# Altium project PCB_STM32F407VGT.PrjPCB
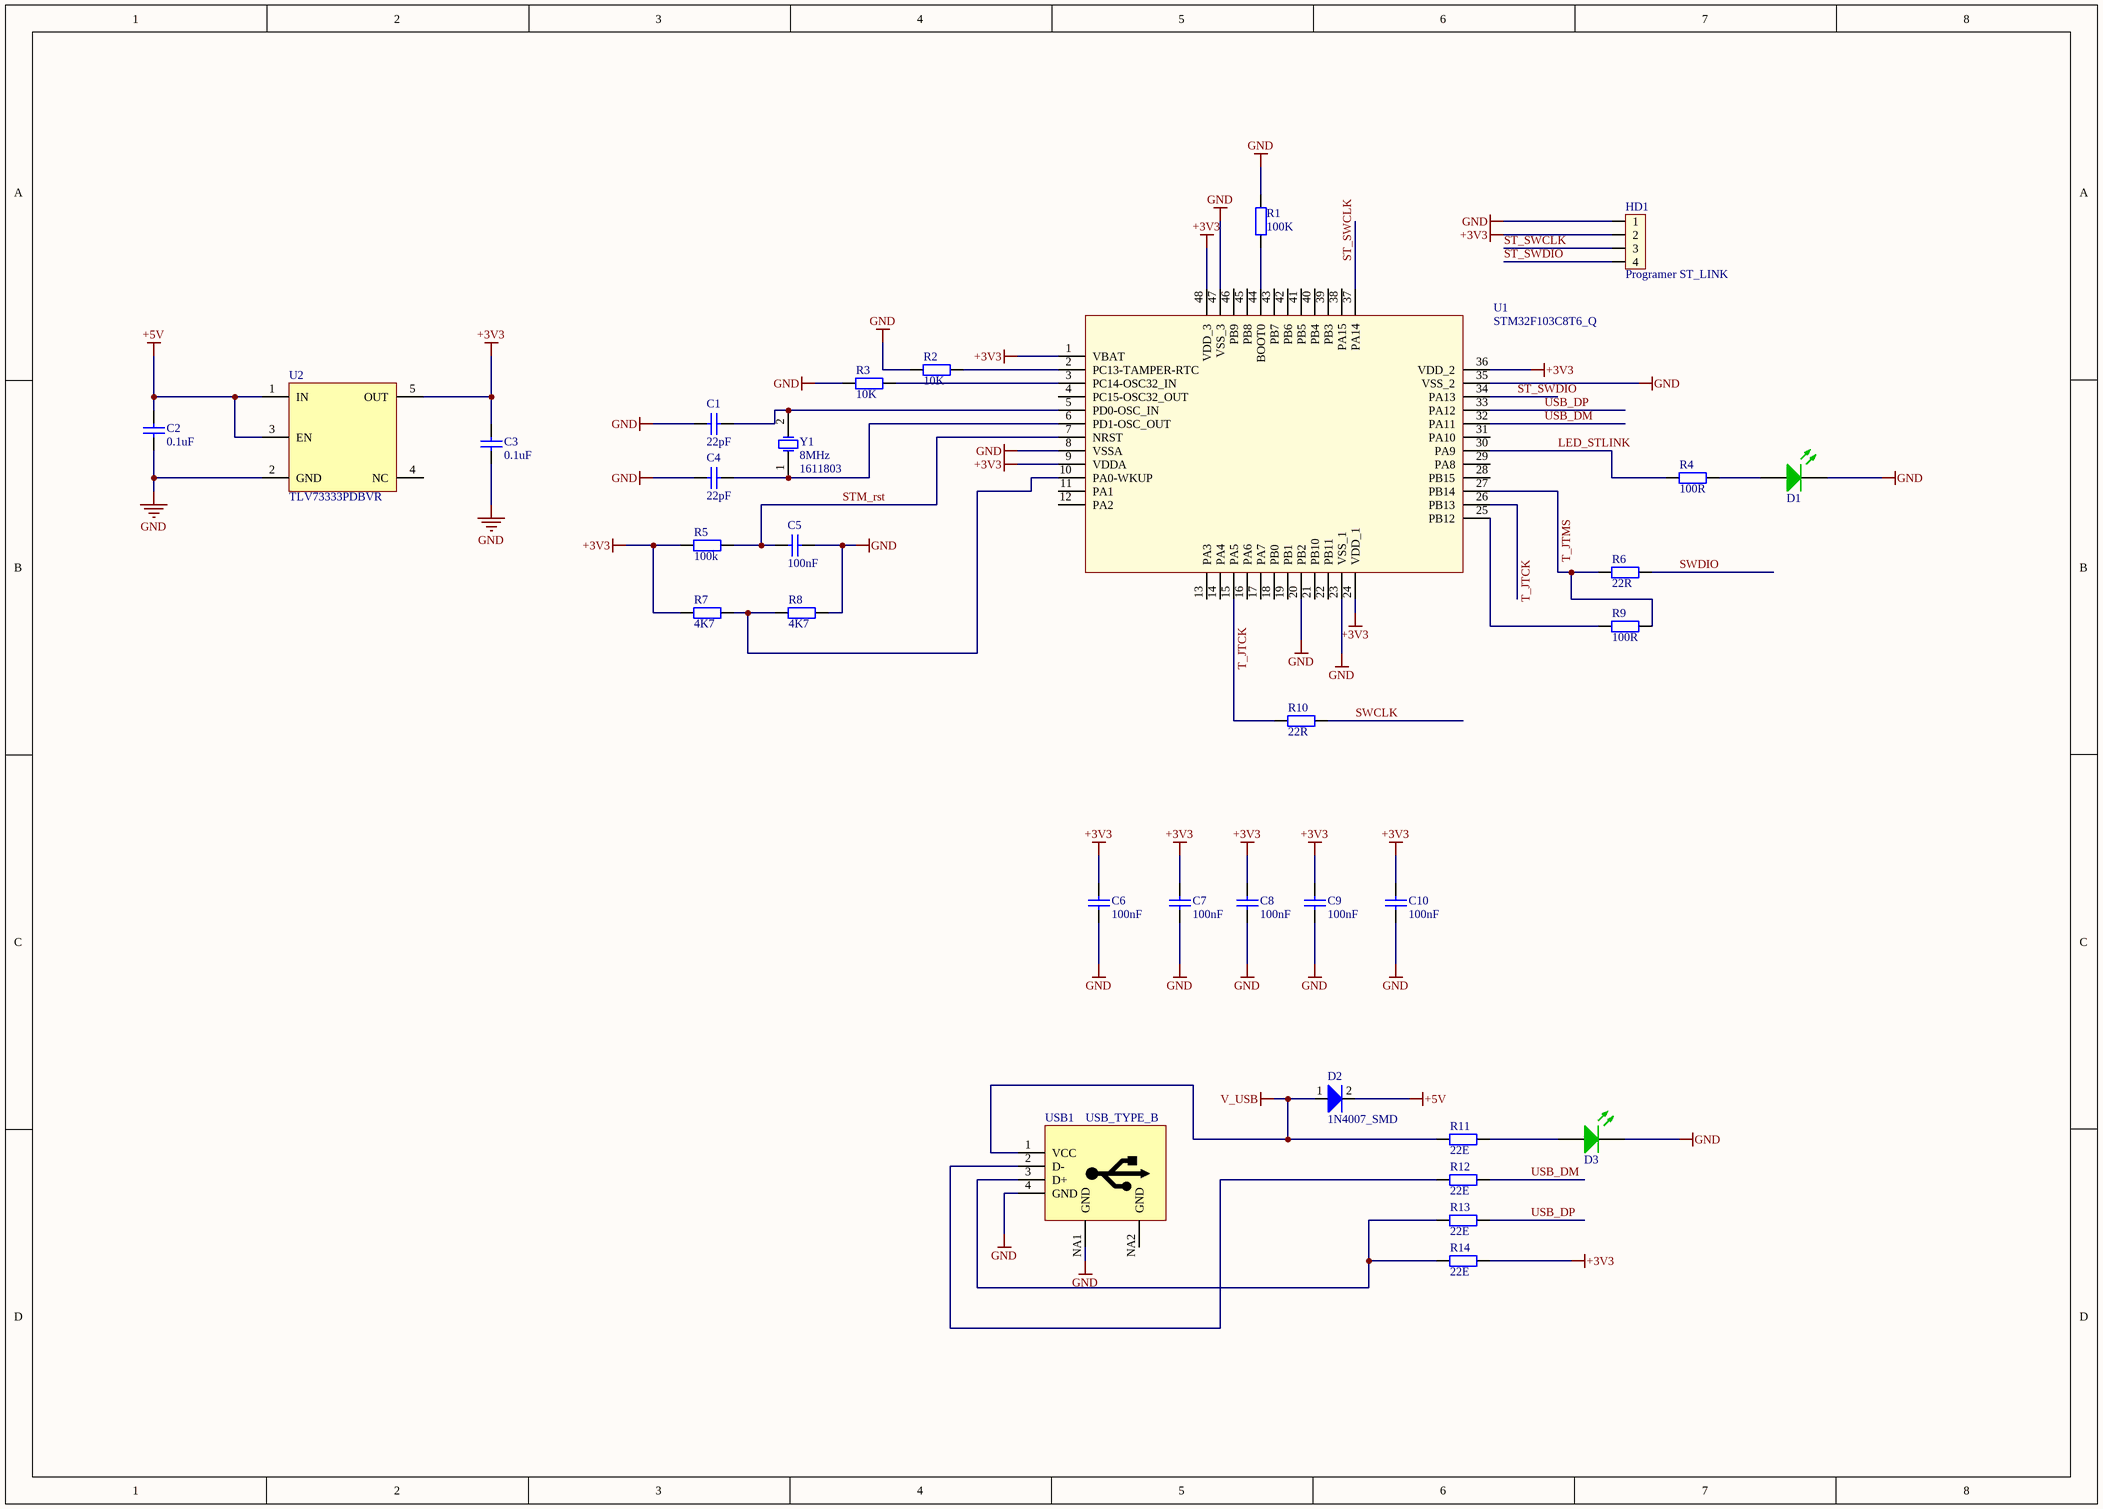
[diagram p0: Sheet2.SchDoc]
2 sheets, 64 parts. Net scope: global (net labels, ports and power ports of the same name join across sheets).
Board file: PCB1.PcbDoc
Sheets:
  Sheet2.SchDoc
  Sheet3.SchDoc

## Sheet Sheet2.SchDoc
size A3

### Parts
C1  value 22pF  [Cap Ceramic 0805 SMD]  (hidden comment: Cap)
C2  value 0.1uF  [Cap Ceramic 0805 SMD]  (hidden comment: Cap)
C3  value 0.1uF  [Cap Ceramic 0805 SMD]  (hidden comment: Cap)
C4  value 22pF  [Cap Ceramic 0805 SMD]  (hidden comment: Cap)
C5  value 100nF  [Cap Ceramic 0805 SMD]  (hidden comment: Cap)
C6  value 100nF  [Cap Ceramic 0805 SMD]  (hidden comment: Cap)
C7  value 100nF  [Cap Ceramic 0805 SMD]  (hidden comment: Cap)
C8  value 100nF  [Cap Ceramic 0805 SMD]  (hidden comment: Cap)
C9  value 100nF  [Cap Ceramic 0805 SMD]  (hidden comment: Cap)
C10  value 100nF  [Cap Ceramic 0805 SMD]  (hidden comment: Cap)
D1  GREEN 0603  [LED 0603 SMD]  (value not drawn)
D2  1N4007_SMD  [1n4007 smd DO214]
D3  GREEN 0603  [LED 0603 SMD]  (value not drawn)
HD1  Programer ST_LINK  [Header_4]
R1  value 100K  [Res 0805 SMD]  (hidden comment: Res2)
R2  value 10K  [Res 0805 SMD]  (hidden comment: Res2)
R3  value 10K  [Res 0805 SMD]  (hidden comment: Res2)
R4  value 100R  [Res 0805 SMD]  (hidden comment: Res2)
R5  value 100k  [Res 0805 SMD]  (hidden comment: Res2)
R6  value 22R  [Res 0805 SMD]  (hidden comment: Res2)
R7  value 4K7  [Res 0805 SMD]  (hidden comment: Res2)
R8  value 4K7  [Res 0805 SMD]  (hidden comment: Res2)
R9  value 100R  [Res 0805 SMD]  (hidden comment: Res2)
R10  value 22R  [Res 0805 SMD]  (hidden comment: Res2)
R11  value 22E  [Res 0805 SMD]  (hidden comment: Res2)
R12  value 22E  [Res 0805 SMD]  (hidden comment: Res2)
R13  value 22E  [Res 0805 SMD]  (hidden comment: Res2)
R14  value 22E  [Res 0805 SMD]  (hidden comment: Res2)
U1  STM32F103C8T6_Q  [STM32F103C8T6_Q]
U2  TLV73333PDBVR  [TLV73333PDBVR - SOT23-65]
USB1  USB_TYPE_B  [USB_MICRO_B]
Y1  8MHz  Farnell:: 1611803  [CRYSTAL]

### Nets
+3V3: C3.2 C6.2 C7.2 C8.2 C9.2 C10.2 HD1.2 R5.1 R7.1 R14.2 U1.1(VBAT) U1.9(VDDA) U1.24(VDD_1) U1.36(VDD_2) U1.48(VDD_3) U2.5(OUT)
+5V: C2.2 D2.2(K) U2.1(IN) U2.3(EN)
GND: C1.1 C2.1 C3.1 C4.1 C5.2 C6.1 C7.1 C8.1 C9.1 C10.1 D1.2(K) D3.2(K) HD1.1 R1.2 R2.1 R3.1 R8.2 U1.8(VSSA) U1.20(PB2) U1.23(VSS_1) U1.35(VSS_2) U1.47(VSS_3) U2.2(GND) USB1.4(GND) USB1.NA1(GND)
V_USB: D2.1(A) R11.1 USB1.1(VCC)
LED_STLINK: R4.1 U1.30(PA9)
ST_SWCLK: HD1.3 U1.37(PA14)
ST_SWDIO: HD1.4 U1.34(PA13)
STM_rst: C5.1 R5.2 U1.7(NRST)
SWCLK: R10.2
SWDIO: R6.2
T_JTCK: R10.1 U1.15(PA5) U1.26(PB13)
T_JTMS: R6.1 R9.2 U1.27(PB14)
USB_DM: R12.2 U1.32(PA11)
USB_DP: R13.2 U1.33(PA12)
NetC1_2: C1.2 U1.5(PD0-OSC_IN) Y1.2(OSC2)
NetC4_2: C4.2 U1.6(PD1-OSC_OUT) Y1.1(OSC1)
NetD1_1: D1.1(A) R4.2
NetD3_1: D3.1(A) R11.2
NetR1_1: R1.1 U1.44(BOOT0)
NetR2_2: R2.2 U1.2(PC13-TAMPER-RTC)
NetR3_2: R3.2 U1.3(PC14-OSC32_IN)
NetR7_2: R7.2 R8.1 U1.10(PA0-WKUP)
NetR9_1: R9.1 U1.25(PB12)
NetR12_1: R12.1 USB1.2(D-)
NetR13_1: R13.1 R14.1 USB1.3(D+)

Not connected (* = marked no-connect by the designer): U1 4(PC15-OSC32_OUT) 11(PA1) 12(PA2) 13(PA3) 14(PA4) 16(PA6) 17(PA7) 18(PB0) 19(PB1) 21(PB10) 22(PB11) 28(PB15) 29(PA8) 31(PA10) 38(PA15) 39(PB3) 40(PB4) 41(PB5) 42(PB6) 43(PB7) 45(PB8) 46(PB9); U2 4(NC); USB1 NA2(GND)

### Library data of the parts
C1-C10 = Cap: Capacitor; Published: 8-Jun-2000; LatestRevisionDate: 17-Jul-2002; LatestRevisionNote: Re-released for DXP Platform.; PackageReference: RAD-0.3; Publisher: Altium Limited
D1 D3 = LED GREEN 0603: LED GREEN CLEAR 0603 SMD; Manufacturer: Lite-On Inc.; Manufacturer Part Number: LTST-C190KGKT; Lens Color: Colorless; Millicandela Rating: 35mcd; Lens Style/Size: Rectangle with Flat Top, 1.10mm x 0.80mm; Voltage - Forward (Vf) (Typ): 2V; Current - Test: 20mA; Viewing Angle: 130°; Wavelength - Dominant: 571nm; Wavelength - Peak: 574nm; RoHS: RoHS Compliant; Category: Optoelectronics; Packaging: Cut Tape (CT); Color: Green; Lens Transparency: Clear; Mounting Type: Surface Mount; Features: -; Package / Case: 0603 (1608 Metric); Supplier Device Package: *; Size / Dimension: 1.60mm L x 0.80mm W; Height (Max): 0.80mm; ComponentLink1URL: http://optoelectronics.liteon.com/upload/download/DS22-2000-074/S_110_LTST-C190KGKT.pdf; ComponentLink1Description: http://optoelectronics.liteon.com/upload/download/DS22-2000-074/S_110_LTST-C190KGKT.pdf; Supplier 1: Digi-Key; Supplier Part Number 1: 160-1435-1-ND
D2 = 1N4007_SMD: Diode LS 1A 1000V DO214-AC; ComponentLink1Description: Datasheet; ComponentLink1URL: D:\Dropbox\Datasheets\Diodes and Rectifiers\Diodes\1N400X.pdf; Unit Price: 0.0072
HD1 = Header4: Header 4; Value: Header 4
R1-R14 = Res2: Resistor; Published: 8-Jun-2000; LatestRevisionDate: 17-Jul-2002; LatestRevisionNote: Re-released for DXP Platform.; PackageReference: AXIAL-0.4; Publisher: Altium Limited
U2 = 20#TLV73333PDBVR: Linear Voltage Regulator IC Positive Fixed 1 Output 3.3V 300mA SOT-23-5; Digikey: 296-40673-1-ND
USB1 = USB_TYPE_B: USB TYPE B
Y1 = XTAL: Crystal Oscillator; Published: 8-Jun-2000; LatestRevisionDate: 17-Jul-2002; LatestRevisionNote: Re-released for DXP Platform.; PackageReference: R38; Publisher: Altium Limited

## Sheet Sheet3.SchDoc
size A3
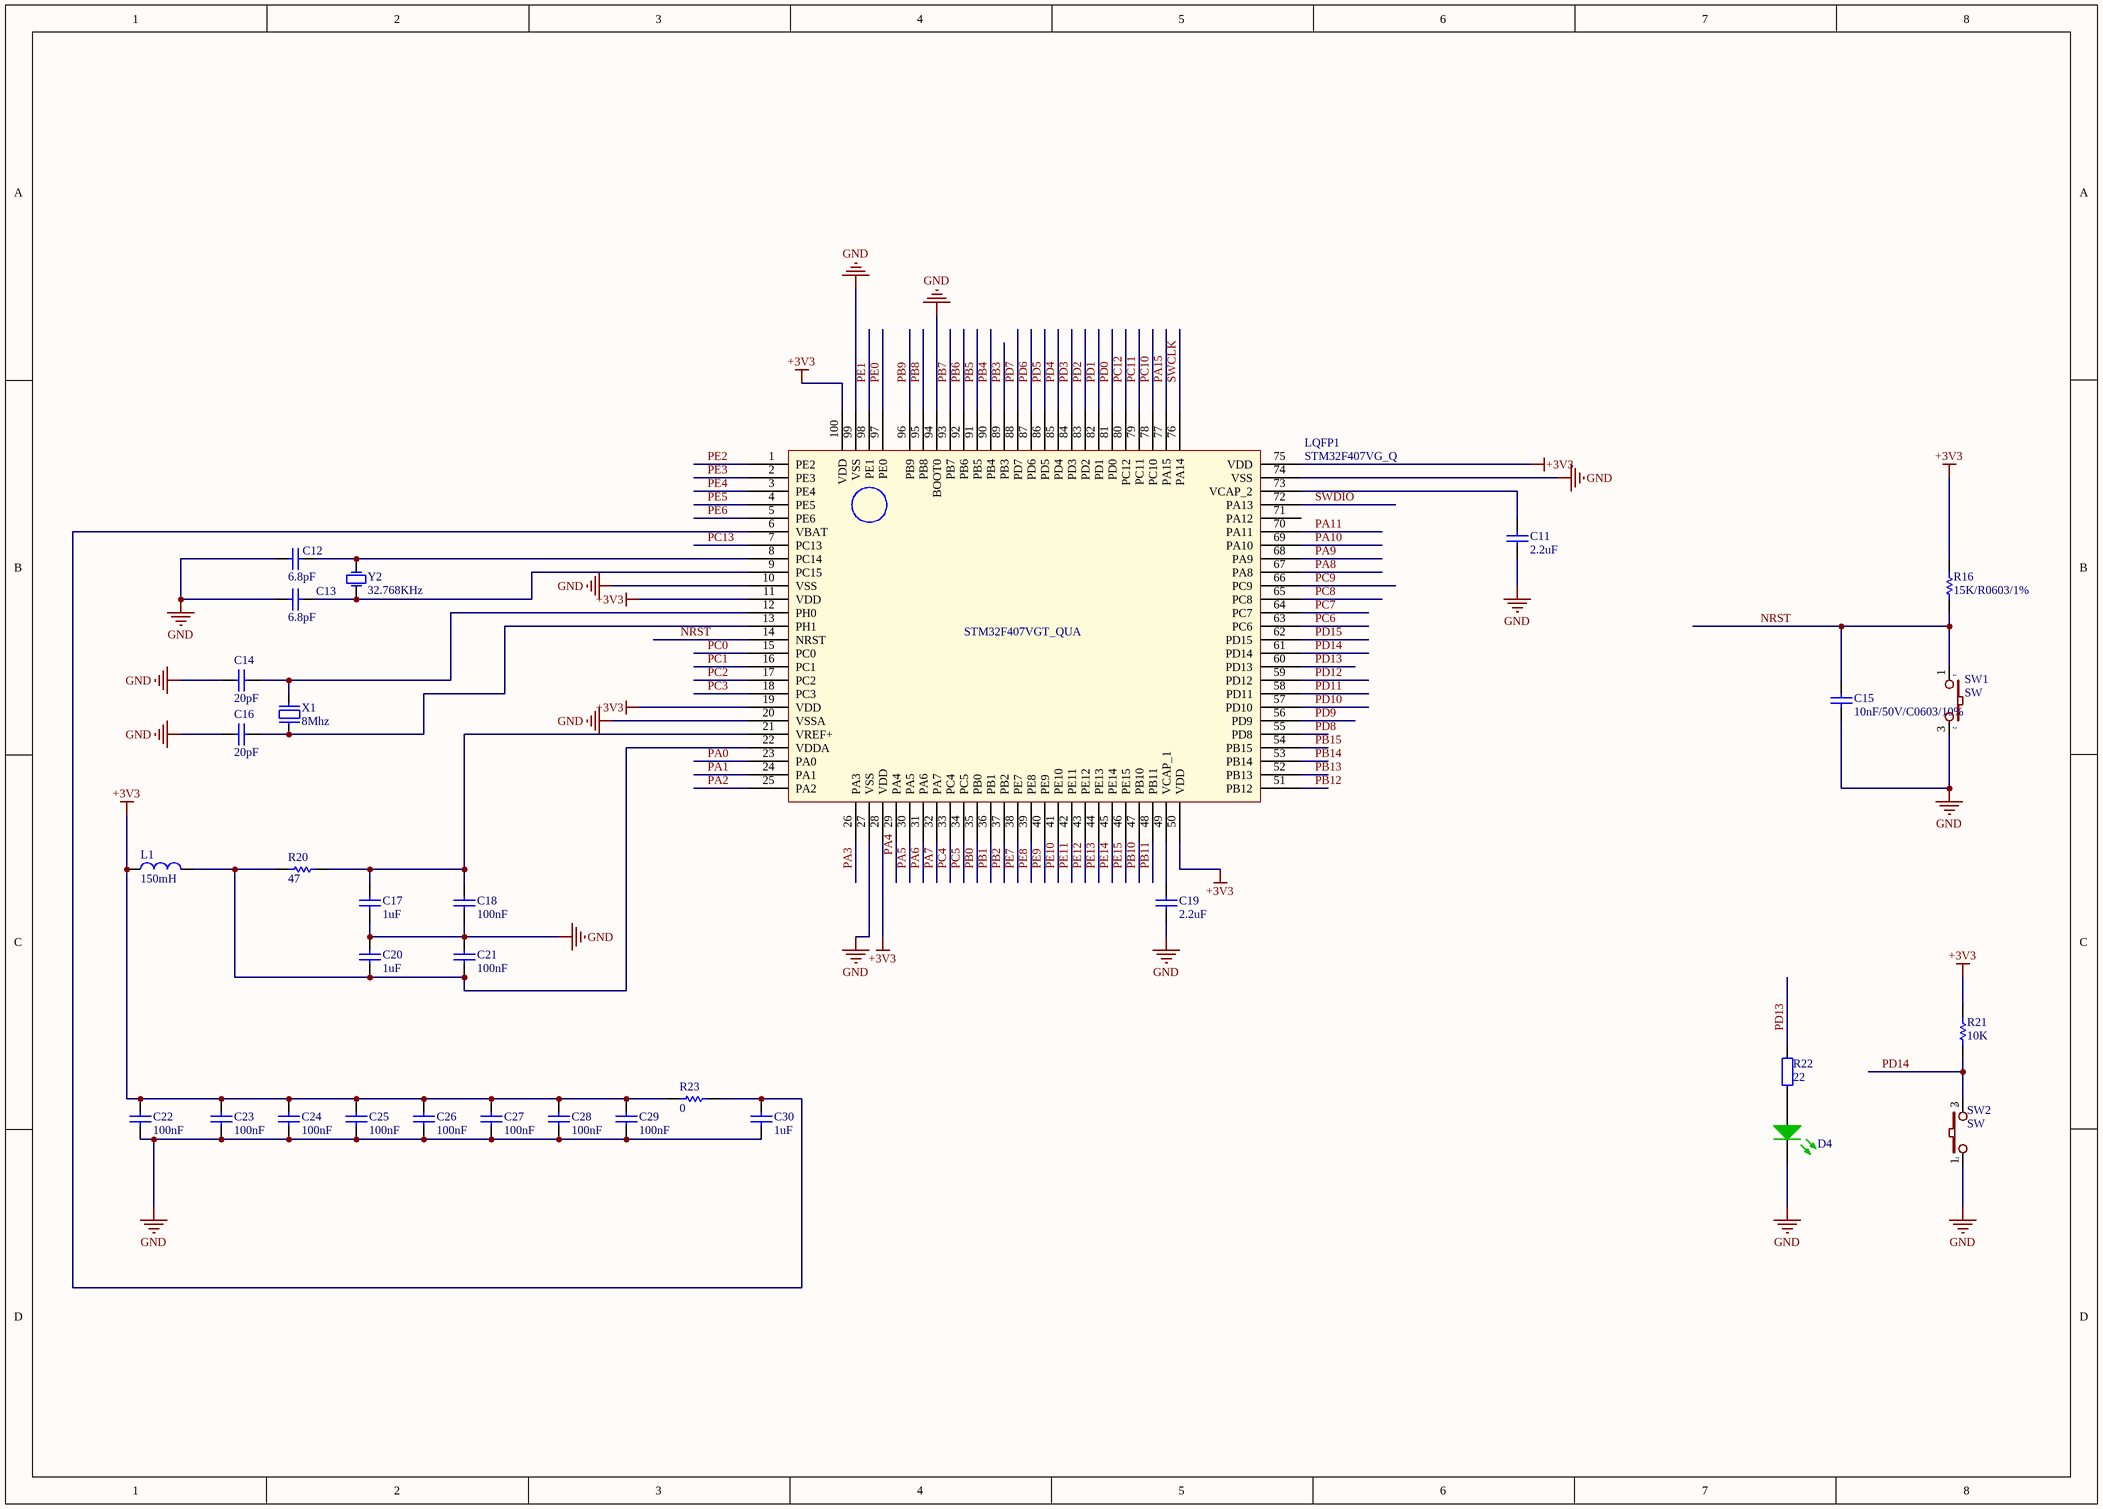
[diagram p1: Sheet3.SchDoc]

### Parts
C11  2.2uF  [Cap Ceramic 0805 SMD]
C12  6.8pF  [Cap Ceramic 0805 SMD]
C13  6.8pF  [Cap Ceramic 0805 SMD]
C14  20pF  [Cap Ceramic 0805 SMD]
C15  10nF/50V/C0603/10%  [Cap Ceramic 0805 SMD]
C16  20pF  [Cap Ceramic 0805 SMD]
C17  1uF  [Cap Ceramic 0805 SMD]
C18  100nF  [Cap Ceramic 0805 SMD]
C19  2.2uF  [Cap Ceramic 0805 SMD]
C20  1uF  [Cap Ceramic 0805 SMD]
C21  100nF  [Cap Ceramic 0805 SMD]
C22  100nF  [Cap Ceramic 0805 SMD]
C23  100nF  [Cap Ceramic 0805 SMD]
C24  100nF  [Cap Ceramic 0805 SMD]
C25  100nF  [Cap Ceramic 0805 SMD]
C26  100nF  [Cap Ceramic 0805 SMD]
C27  100nF  [Cap Ceramic 0805 SMD]
C28  100nF  [Cap Ceramic 0805 SMD]
C29  100nF  [Cap Ceramic 0805 SMD]
C30  1uF  [Cap Ceramic 0805 SMD]
D4  GREEN 0603  [Led 0805G]  (value not drawn)
L1  150mH  [Res 0805 SMD]
LQFP1  STM32F407VG_Q  [STM32F407VG]
R16  15K/R0603/1%  [Res 0805 SMD]
R20  47  [Res 0805 SMD]
R21  10K  [Res 0805 SMD]
R22  value 22  [Res 0805 SMD]  (hidden comment: Res2)
R23  0  [Res 0805 SMD]
SW1  SW  [BUTTON 4 PIN]
SW2  SW  [BUTTON 4 PIN]
X1  8Mhz  [CRYSTAL]
Y2  value 32.768KHz  [CR_32768]  (hidden comment: FC-135R - 32.768KHz)

### Nets
+3V3: C22.2 C23.2 C24.2 C25.2 C26.2 C27.2 C28.2 C29.2 L1.1 LQFP1.11(VDD) LQFP1.19(VDD) LQFP1.28(VDD) LQFP1.50(VDD) LQFP1.75(VDD) LQFP1.100(VDD) R16.2 R21.2 R23.2
GND: C11.1 C12.2 C13.2 C14.2 C15.1 C16.2 C17.1 C18.1 C19.1 C20.2 C21.2 C22.1 C23.1 C24.1 C25.1 C26.1 C27.1 C28.1 C29.1 C30.1 D4.2(K) LQFP1.10(VSS) LQFP1.20(VSSA) LQFP1.27(VSS) LQFP1.74(VSS) LQFP1.94(BOOT0) LQFP1.99(VSS) SW1.3 SW2.1
NRST: C15.2 LQFP1.14(NRST) R16.1 SW1.1
PA0: LQFP1.23(PA0)
PA1: LQFP1.24(PA1)
PA2: LQFP1.25(PA2)
PA3: LQFP1.26(PA3)
PA4: LQFP1.29(PA4)
PA5: LQFP1.30(PA5)
PA6: LQFP1.31(PA6)
PA7: LQFP1.32(PA7)
PA8: LQFP1.67(PA8)
PA9: LQFP1.68(PA9)
PA10: LQFP1.69(PA10)
PA11: LQFP1.70(PA11)
PA15: LQFP1.77(PA15)
PB0: LQFP1.35(PB0)
PB1: LQFP1.36(PB1)
PB2: LQFP1.37(PB2)
PB3: LQFP1.89(PB3)
PB4: LQFP1.90(PB4)
PB5: LQFP1.91(PB5)
PB6: LQFP1.92(PB6)
PB7: LQFP1.93(PB7)
PB8: LQFP1.95(PB8)
PB9: LQFP1.96(PB9)
PB10: LQFP1.47(PB10)
PB11: LQFP1.48(PB11)
PB12: LQFP1.51(PB12)
PB13: LQFP1.52(PB13)
PB14: LQFP1.53(PB14)
PB15: LQFP1.54(PB15)
PC0: LQFP1.15(PC0)
PC1: LQFP1.16(PC1)
PC2: LQFP1.17(PC2)
PC3: LQFP1.18(PC3)
PC4: LQFP1.33(PC4)
PC5: LQFP1.34(PC5)
PC6: LQFP1.63(PC6)
PC7: LQFP1.64(PC7)
PC8: LQFP1.65(PC8)
PC9: LQFP1.66(PC9)
PC10: LQFP1.78(PC10)
PC11: LQFP1.79(PC11)
PC12: LQFP1.80(PC12)
PC13: LQFP1.7(PC13)
PD0: LQFP1.81(PD0)
PD1: LQFP1.82(PD1)
PD2: LQFP1.83(PD2)
PD3: LQFP1.84(PD3)
PD4: LQFP1.85(PD4)
PD5: LQFP1.86(PD5)
PD6: LQFP1.87(PD6)
PD7: LQFP1.88(PD7)
PD8: LQFP1.55(PD8)
PD9: LQFP1.56(PD9)
PD10: LQFP1.57(PD10)
PD11: LQFP1.58(PD11)
PD12: LQFP1.59(PD12)
PD13: LQFP1.60(PD13) R22.1
PD14: LQFP1.61(PD14) R21.1 SW2.3
PD15: LQFP1.62(PD15)
PE0: LQFP1.97(PE0)
PE1: LQFP1.98(PE1)
PE2: LQFP1.1(PE2)
PE3: LQFP1.2(PE3)
PE4: LQFP1.3(PE4)
PE5: LQFP1.4(PE5)
PE6: LQFP1.5(PE6)
PE7: LQFP1.38(PE7)
PE8: LQFP1.39(PE8)
PE9: LQFP1.40(PE9)
PE10: LQFP1.41(PE10)
PE11: LQFP1.42(PE11)
PE12: LQFP1.43(PE12)
PE13: LQFP1.44(PE13)
PE14: LQFP1.45(PE14)
PE15: LQFP1.46(PE15)
SWCLK: LQFP1.76(PA14)
SWDIO: LQFP1.72(PA13)
NetC11_2: C11.2 LQFP1.73(VCAP_2)
NetC12_1: C12.1 LQFP1.8(PC14) Y2.2(OSC2)
NetC13_1: C13.1 LQFP1.9(PC15) Y2.1(OSC1)
NetC14_1: C14.1 LQFP1.12(PH0) X1.2
NetC16_1: C16.1 LQFP1.13(PH1) X1.1
NetC17_2: C17.2 C18.2 LQFP1.21(VREF+) R20.1
NetC19_2: C19.2 LQFP1.49(VCAP_1)
NetC20_1: C20.1 C21.1 L1.2 LQFP1.22(VDDA) R20.2
NetC30_2: C30.2 LQFP1.6(VBAT) R23.1
NetD4_1: D4.1(A) R22.2

Not connected (* = marked no-connect by the designer): LQFP1 71(PA12)

### Notes on the sheet
- (in symbol STM32F407VG_Q) STM32F407VGT_QUA
- (in symbol SW2) 2

### Library data of the parts
C11-C14 C16-C30 = 22pF/50V/C0603/10%: CAP CER 22PF 50V NP0 0603; Manufacturer: Kemet; Manufacturer Part Number: C0603C220K5GACTU; Tolerance: ±10%; Temperature Coefficient: C0G, NP0; RoHS: RoHS Compliant; Category: Capacitors; Packaging: Digi-Reel®; Capacitance: 22pF; Voltage - Rated: 50V; Mounting Type: Surface Mount, MLCC; Operating Temperature: -55°C ~ 125°C; Applications: General Purpose; Ratings: -; Package / Case: 0603 (1608 Metric); Size / Dimension: 0.063" L x 0.031" W (1.60mm x 0.80mm); Height - Seated (Max): -; Thickness (Max): 0.034" (0.87mm); Lead Spacing: -; Features: -; Lead Style: -; ComponentLink1URL: http://www.kemet.com/docfinder?Partnumber=C0603C220K5GACTU; ComponentLink1Description: http://www.kemet.com/docfinder?Partnumber=C0603C220K5GACTU; Supplier 1: Digi-Key; Supplier Part Number 1: 399-7875-1-ND
C15 = 10nF/50V/C0603/10%_1: CAP CER 10000PF 50V X7R 0603; Manufacturer: Murata Electronics North America; Manufacturer Part Number: GRM188R71H103KA01D; Tolerance: ±10%; RoHS: RoHS Compliant; Category: Capacitors; Packaging: Cut Tape (CT); Capacitance: 10000pF; Voltage - Rated: 50V; Temperature Coefficient: X7R; Mounting Type: Surface Mount, MLCC; Operating Temperature: -55°C ~ 125°C; Applications: General Purpose; Ratings: -; Package / Case: 0603 (1608 Metric); Size / Dimension: 0.063" L x 0.031" W (1.60mm x 0.80mm); Height - Seated (Max): -; Thickness (Max): 0.035" (0.90mm); Lead Spacing: -; Features: -; Lead Style: -; ComponentLink1URL: http://www.murata.com/~/media/webrenewal/support/library/catalog/products/capacitor/mlcc/c02e.ashx; ComponentLink1Description: http://www.murata.com/~/media/webrenewal/support/library/catalog/products/capacitor/mlcc/c02e.ashx; Supplier 1: Digi-Key; Supplier Part Number 1: 490-1512-1-ND
D4 = LED GREEN 0603: as D1 on sheet Sheet2; RoHS: RoHS Compliant; Category: Optoelectronics; Packaging: Cut Tape (CT); Color: Green; Lens Transparency: Clear; Mounting Type: Surface Mount; Features: -; Package / Case: 0603 (1608 Metric); Supplier Device Package: *; Size / Dimension: 1.60mm L x 0.80mm W; Height (Max): 0.80mm; ComponentLink1URL: http://optoelectronics.liteon.com/upload/download/DS22-2000-074/S_110_LTST-C190KGKT.pdf; ComponentLink1Description: http://optoelectronics.liteon.com/upload/download/DS22-2000-074/S_110_LTST-C190KGKT.pdf; Supplier 1: Digi-Key; Supplier Part Number 1: 160-1435-1-ND
L1 = L1: Inductor; Value: 150 mH
R16 R21 = 15K/R0603/1%_1: RES SMD 15K OHM 1% 1/10W 0603; Manufacturer: Yageo; Manufacturer Part Number: RC0603FR-0715KL; Power (Watts): 0.1W, 1/10W; Temperature Coefficient: ±100ppm/°C; RoHS: RoHS Compliant; Category: Resistors; Packaging: Digi-Reel®; Resistance (Ohms): 15k; Tolerance: ±1%; Composition: Thick Film; Features: Moisture Resistant; Operating Temperature: -55°C ~ 155°C; Package / Case: 0603 (1608 Metric); Supplier Device Package: 0603; Size / Dimension: 0.063" L x 0.031" W (1.60mm x 0.80mm); Height: 0.022" (0.55mm); Number of Terminations: 2; ComponentLink1URL: http://www.yageo.com/NewPortal/yageodocoutput?fileName=/pdf/R-Chip/PYu-RC_Group_51_RoHS_L_3.pdf; ComponentLink1Description: http://www.yageo.com/NewPortal/yageodocoutput?fileName=/pdf/R-Chip/PYu-RC_Group_51_RoHS_L_3.pdf; Supplier 1: Digi-Key; Supplier Part Number 1: 311-15.0KHRCT-ND
R20 R23 = 10K/R0603/1%: RES SMD 10K OHM 1% 1/10W 0603; Manufacturer: Yageo; Manufacturer Part Number: RC0603FR-0710KL; Power (Watts): 0.1W, 1/10W; Temperature Coefficient: ±100ppm/°C; Supplier 1: Digi-Key; RoHS: RoHS Compliant; Category: Resistors; Stock 1: 11440000; Pricing 1: 5000=0.00167, 10000=0.00145, 25000=0.00128, 50000=0.00117, 125000=0.00115 (USD); Packaging: Tape & Reel (TR); Resistance (Ohms): 10k; Tolerance: ±1%; Composition: Thick Film; Features: Moisture Resistant; Operating Temperature: -55°C ~ 155°C; Package / Case: 0603 (1608 Metric); Supplier Device Package: 0603; Size / Dimension: 0.063" L x 0.031" W (1.60mm x 0.80mm); Height: 0.022" (0.55mm); Number of Terminations: 2; ComponentLink1URL: http://www.yageo.com/NewPortal/yageodocoutput?fileName=/pdf/R-Chip/PYu-RC_Group_51_RoHS_L_3.pdf; ComponentLink1Description: http://www.yageo.com/NewPortal/yageodocoutput?fileName=/pdf/R-Chip/PYu-RC_Group_51_RoHS_L_3.pdf; Supplier Part Number 1: 311-10.0KHRTR-ND
R22 = Res2: Resistor; Published: 8-Jun-2000; LatestRevisionDate: 17-Jul-2002; LatestRevisionNote: Re-released for DXP Platform.; PackageReference: AXIAL-0.4; Publisher: Altium Limited
SW1 SW2 = SW2: Switch button 2 pin; Value: SW chip 2 pin
X1 = XT32k: Crystal 32,768kHz for timer real; Value: 32,768khz
Y2 = FC-135R - 32.768KHz: Crystal FC-135R - 32.768KHz; ComponentLink1Description: Datasheet; ComponentLink1URL: D:\Dropbox\Datasheets\Passive Components\Crystals\HC49S.pdf; Unit Price: 0.0440

## Nets that join several sheets
+3V3: Sheet2 (16 pins), Sheet3 (18 pins)
GND: Sheet2 (25 pins), Sheet3 (29 pins)
SWCLK: Sheet2 (R10.2), Sheet3 (LQFP1.76)
SWDIO: Sheet2 (R6.2), Sheet3 (LQFP1.72)